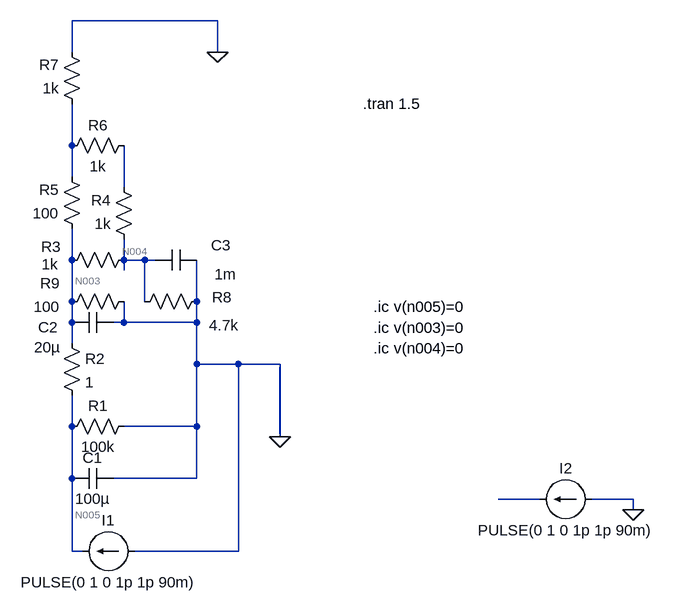
[diagram p0: schematic uno.asc]
uno.asc, the LTspice schematic file:
Version 4
SHEET 1 1324 680
WIRE 624 -448 400 -448
WIRE 400 -400 400 -448
WIRE 624 -400 624 -448
WIRE 400 -256 400 -320
WIRE 400 -208 400 -256
WIRE 480 -192 480 -256
WIRE 400 -80 400 -128
WIRE 480 -80 480 -112
WIRE 512 -80 480 -80
WIRE 528 -80 512 -80
WIRE 480 -64 480 -80
WIRE 400 -16 400 -80
WIRE 512 -16 512 -80
WIRE 592 -16 592 -80
WIRE 400 16 400 -16
WIRE 480 16 480 -16
WIRE 480 16 464 16
WIRE 592 16 592 -16
WIRE 592 16 480 16
WIRE 400 48 400 16
WIRE 592 80 592 16
WIRE 656 80 592 80
WIRE 720 80 656 80
WIRE 400 176 400 128
WIRE 592 176 592 80
WIRE 592 176 480 176
WIRE 720 192 720 80
WIRE 400 256 400 176
WIRE 592 256 592 176
WIRE 592 256 464 256
WIRE 1120 288 1056 288
WIRE 1264 288 1200 288
WIRE 1264 304 1264 288
WIRE 400 368 400 256
WIRE 416 368 400 368
WIRE 656 368 656 80
WIRE 656 368 496 368
FLAG 624 -400 0
FLAG 720 192 0
FLAG 1264 304 0
SYMBOL cap 464 240 R90
WINDOW 0 0 32 VBottom 2
WINDOW 3 32 32 VTop 2
SYMATTR InstName C1
SYMATTR Value 100µ
SYMBOL res 496 160 R90
WINDOW 0 0 56 VBottom 2
WINDOW 3 32 56 VTop 2
SYMATTR InstName R1
SYMATTR Value 100k
SYMBOL res 384 32 R0
SYMATTR InstName R2
SYMATTR Value 1
SYMBOL cap 464 0 R90
WINDOW 0 39 101 VBottom 2
WINDOW 3 39 102 VTop 2
SYMATTR InstName C2
SYMATTR Value 20µ
SYMBOL res 496 -96 R90
WINDOW 0 11 128 VBottom 2
WINDOW 3 7 130 VTop 2
SYMATTR InstName R3
SYMATTR Value 1k
SYMBOL res 496 -96 R180
WINDOW 0 36 76 Left 2
WINDOW 3 36 40 Left 2
SYMATTR InstName R4
SYMATTR Value 1k
SYMBOL res 416 -112 R180
WINDOW 0 36 76 Left 2
WINDOW 3 36 40 Left 2
SYMATTR InstName R5
SYMATTR Value 100
SYMBOL res 496 -272 R90
WINDOW 0 0 56 VBottom 2
WINDOW 3 32 56 VTop 2
SYMATTR InstName R6
SYMATTR Value 1k
SYMBOL res 416 -304 R180
WINDOW 0 36 76 Left 2
WINDOW 3 36 40 Left 2
SYMATTR InstName R7
SYMATTR Value 1k
SYMBOL cap 592 -96 R90
WINDOW 0 9 -37 VBottom 2
WINDOW 3 22 -44 VTop 2
SYMATTR InstName C3
SYMATTR Value 1m
SYMBOL current 496 368 R90
WINDOW 0 -32 40 VBottom 2
WINDOW 3 32 40 VTop 2
WINDOW 123 0 0 Left 0
WINDOW 39 0 0 Left 0
SYMATTR InstName I1
SYMATTR Value PULSE(0 1 0 1p 1p 90m)
SYMBOL res 608 -32 R90
WINDOW 0 25 -23 VBottom 2
WINDOW 3 37 -26 VTop 2
SYMATTR InstName R8
SYMATTR Value 4.7k
SYMBOL res 496 -32 R90
WINDOW 0 3 130 VBottom 2
WINDOW 3 8 135 VTop 2
SYMATTR InstName R9
SYMATTR Value 100
SYMBOL current 1200 288 R90
WINDOW 0 -32 40 VBottom 2
WINDOW 3 32 40 VTop 2
WINDOW 123 0 0 Left 0
WINDOW 39 0 0 Left 0
SYMATTR InstName I2
SYMATTR Value PULSE(0 1 0 1p 1p 90m)
TEXT 864 -8 Left 2 !.ic v(n005)=0
TEXT 864 24 Left 2 !.ic v(n003)=0
TEXT 864 56 Left 2 !.ic v(n004)=0
TEXT 848 -320 Left 2 !.tran 1.5

The netlist it stands for:
* uno.asc
C1 0 N005 100µ
R1 0 N005 100k
R2 N003 N005 1
C2 0 N003 20µ
R3 N004 N003 1k
R4 N004 N002 1k
R5 N003 N001 100
R6 N002 N001 1k
R7 N001 0 1k
C3 0 N004 1m
I1 0 N005 PULSE(0 1 0 1p 1p 90m)
R8 0 N004 4.7k
R9 0 N003 100
I2 0 N006 PULSE(0 1 0 1p 1p 90m)
.ic v(n005)=0
.ic v(n003)=0
.ic v(n004)=0
.tran 1.5
.backanno
.end